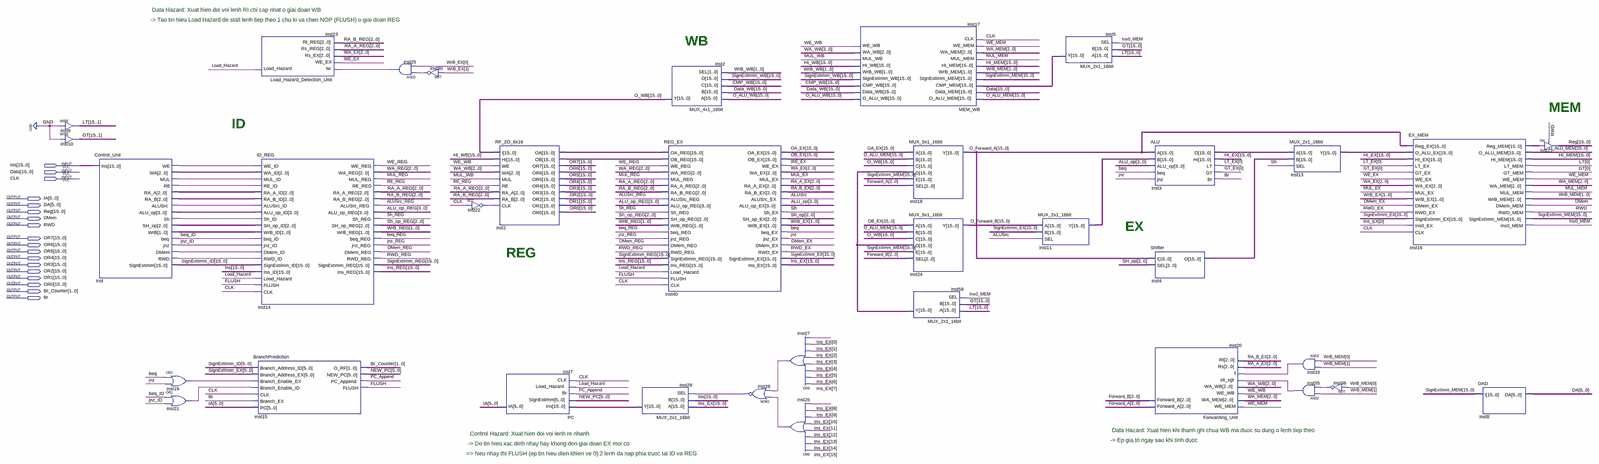
[diagram p0: schematic sheet, whole]
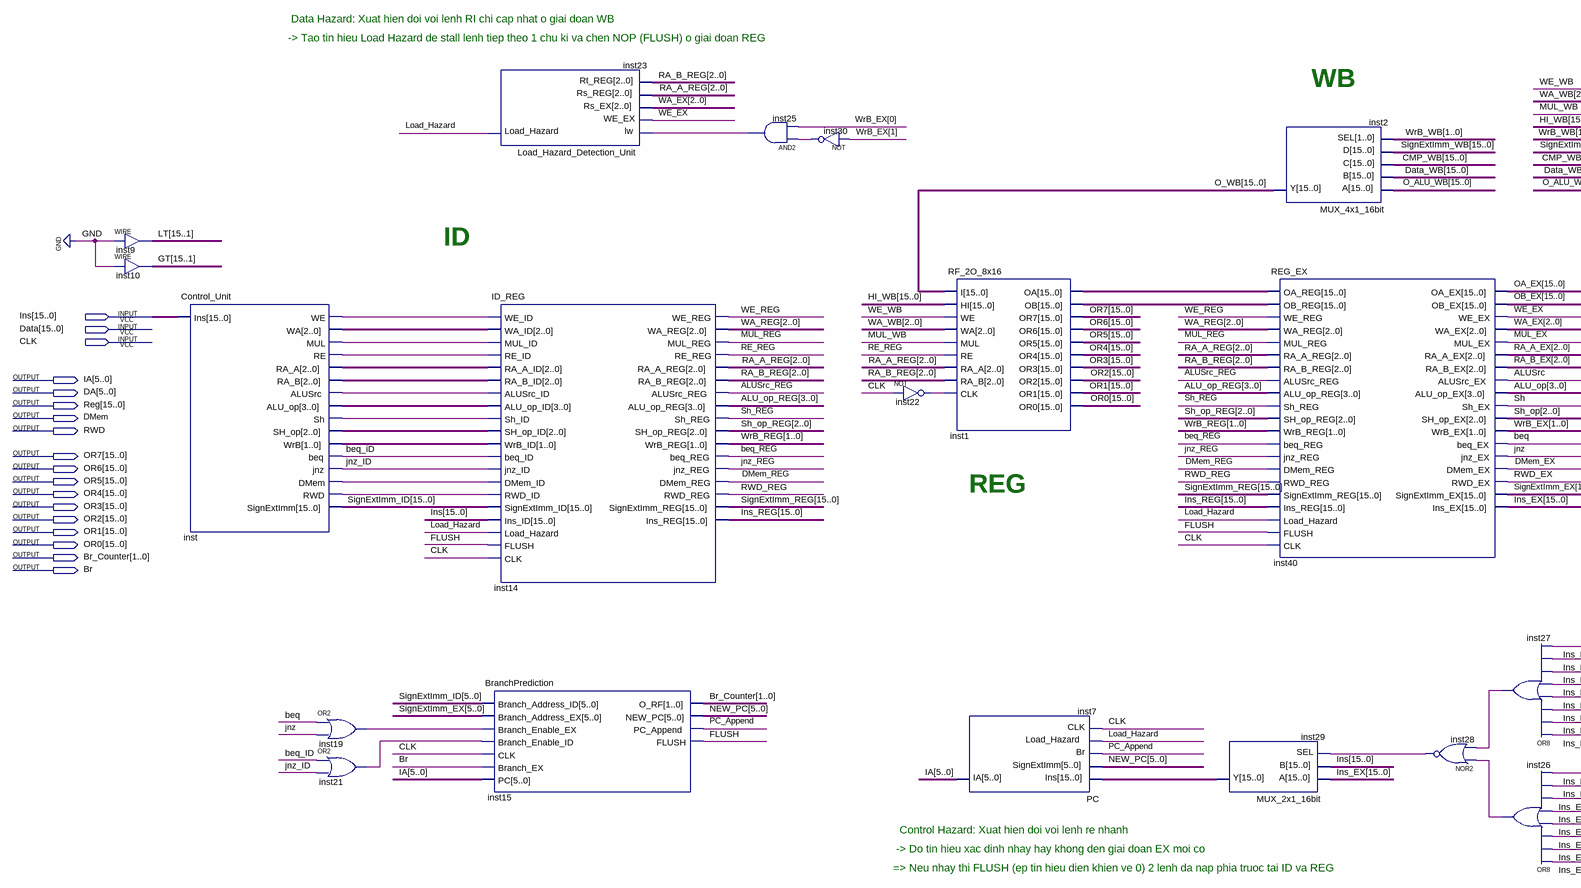
[diagram p1: schematic sheet, left part]
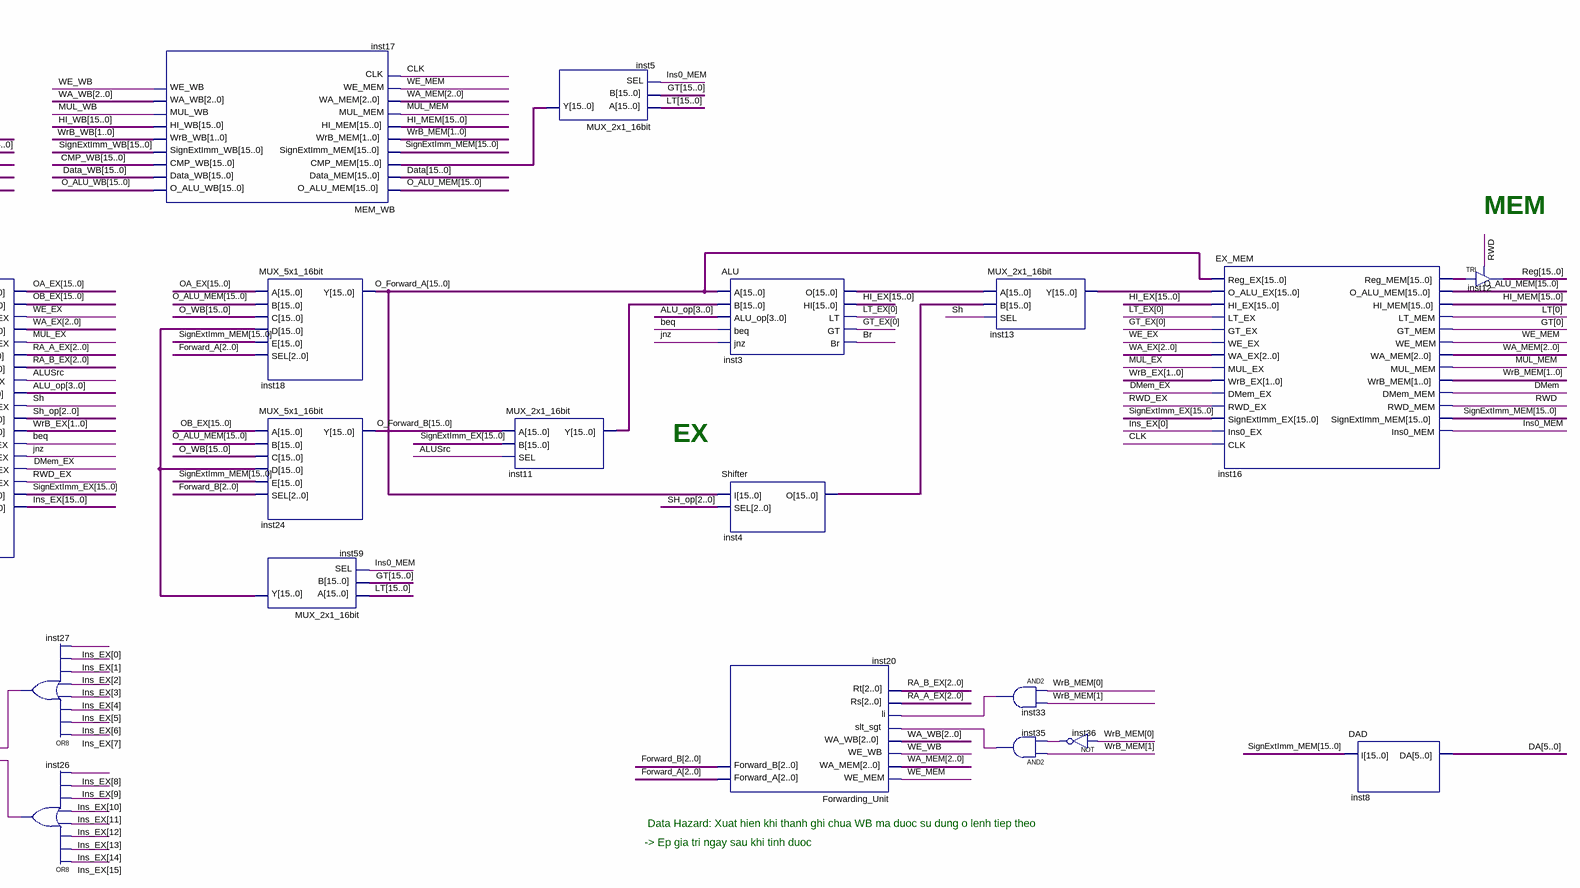
[diagram p2: schematic sheet, right part]
// Quartus schematic CPU_16bit.bdf as structural Verilog: 35 symbols, 18 pins
module CPU_16bit (
  input  [15:0] Ins,
  input  [15:0] Data,
  input  CLK,
  output [5:0] IA,
  output [5:0] DA,
  output [15:0] Reg,
  output DMem,
  output RWD,
  output [15:0] OR7,
  output [15:0] OR6,
  output [15:0] OR5,
  output [15:0] OR4,
  output [15:0] OR3,
  output [15:0] OR2,
  output [15:0] OR1,
  output [15:0] OR0,
  output [1:0] Br_Counter,
  output Br
);

  wire ALUSrc, ALUSrc_REG, beq, beq_iD, beq_REG, DMem_EX, DMem_REG, FLUSH, Ins0_MEM, inst19_out, inst21_out,
       inst22_out, inst25_out, inst26_out, inst27_out, inst28_out, inst30_out, inst33_out, inst35_out,
       inst36_out, inst_alusrc, inst_dmem, inst_mul, inst_re, inst_rwd, inst_sh, inst_we, jnz, jnz_ID,
       jnz_REG, Load_Hazard, MUL_EX, MUL_MEM, MUL_REG, MUL_WB, PC_Append, RE_REG, RWD_EX, RWD_REG, Sh,
       Sh_REG, WE_EX, WE_MEM, WE_REG, WE_WB;
  wire [0:0] GT_EX, LT_EX;
  wire [1:0] inst_wrb, WrB_EX, WrB_MEM, WrB_REG, WrB_WB;
  wire [2:0] Forward_A, Forward_B, inst_ra_a, inst_ra_b, inst_sh_op, inst_wa, RA_A_EX, RA_A_REG, RA_B_EX,
       RA_B_REG, Sh_op, Sh_op_REG, WA_EX, WA_MEM, WA_REG, WA_WB;
  wire [3:0] ALU_op, ALU_op_REG, inst_alu_op;
  wire [5:0] NEW_PC;
  wire [15:0] CMP_WB, Data_WB, GT, HI_EX, HI_MEM, HI_WB, Ins_EX, Ins_REG, inst1_oa, inst1_ob, inst3_o,
       inst4_o, inst5_y, inst11_y, inst13_y, inst16_reg_mem, inst29_y, inst59_y, LT, O_ALU_MEM, O_ALU_WB,
       O_Forward_A, O_Forward_B, O_WB, OA_EX, OB_EX, SignExtImm_EX, SignExtImm_ID, SignExtImm_MEM,
       SignExtImm_REG, SignExtImm_WB;

  assign LT[15:1] = {15{1'b0}};  // WIRE inst9
  assign GT[15:1] = {15{1'b0}};  // WIRE inst10
  Control_Unit inst (
    .Ins(Ins), .WE(inst_we), .WA(inst_wa), .MUL(inst_mul), .RE(inst_re), .RA_A(inst_ra_a), .RA_B(inst_ra_b),
    .ALUSrc(inst_alusrc), .ALU_op(inst_alu_op), .Sh(inst_sh), .SH_op(inst_sh_op), .WrB(inst_wrb),
    .beq(beq_iD), .jnz(jnz_ID), .DMem(inst_dmem), .RWD(inst_rwd), .SignExtImm(SignExtImm_ID));
  or inst19 (inst19_out, beq, jnz);
  or inst21 (inst21_out, beq_iD, jnz_ID);
  BranchPrediction inst15 (
    .Branch_Address_ID(SignExtImm_ID[5:0]), .Branch_Address_EX(SignExtImm_EX[5:0]),
    .Branch_Enable_EX(inst19_out), .Branch_Enable_ID(inst21_out), .CLK(CLK), .Branch_EX(Br), .PC(IA),
    .O_RF(Br_Counter), .NEW_PC(NEW_PC), .PC_Append(PC_Append), .FLUSH(FLUSH));
  Load_Hazard_Detection_Unit inst23 (
    .lw(inst25_out), .WE_EX(WE_EX), .Rs_EX(WA_EX), .Rs_REG(RA_A_REG), .Rt_REG(RA_B_REG),
    .Load_Hazard(Load_Hazard));
  ID_REG inst14 (
    .WE_ID(inst_we), .WA_ID(inst_wa), .MUL_ID(inst_mul), .RE_ID(inst_re), .RA_A_ID(inst_ra_a),
    .RA_B_ID(inst_ra_b), .ALUSrc_ID(inst_alusrc), .ALU_op_ID(inst_alu_op), .Sh_ID(inst_sh),
    .SH_op_ID(inst_sh_op), .WrB_ID(inst_wrb), .beq_ID(beq_iD), .jnz_ID(jnz_ID), .DMem_ID(inst_dmem),
    .RWD_ID(inst_rwd), .SignExtImm_ID(SignExtImm_ID), .Ins_ID(Ins), .Load_Hazard(Load_Hazard), .FLUSH(FLUSH),
    .CLK(CLK), .WE_REG(WE_REG), .WA_REG(WA_REG), .MUL_REG(MUL_REG), .RE_REG(RE_REG), .RA_A_REG(RA_A_REG),
    .RA_B_REG(RA_B_REG), .ALUSrc_REG(ALUSrc_REG), .ALU_op_REG(ALU_op_REG), .Sh_REG(Sh_REG),
    .SH_op_REG(Sh_op_REG), .WrB_REG(WrB_REG), .beq_REG(beq_REG), .jnz_REG(jnz_REG), .DMem_REG(DMem_REG),
    .RWD_REG(RWD_REG), .SignExtImm_REG(SignExtImm_REG), .Ins_REG(Ins_REG));
  and inst25 (inst25_out, inst30_out, WrB_EX[0]);
  not inst30 (inst30_out, WrB_EX[1]);
  not inst22 (inst22_out, CLK);
  RF_2O_8x16 inst1 (
    .I(O_WB), .HI(HI_WB), .WE(WE_WB), .WA(WA_WB), .MUL(MUL_WB), .RE(RE_REG), .RA_A(RA_A_REG),
    .RA_B(RA_B_REG), .CLK(inst22_out), .OA(inst1_oa), .OB(inst1_ob), .OR7(OR7), .OR6(OR6), .OR5(OR5),
    .OR4(OR4), .OR3(OR3), .OR2(OR2), .OR1(OR1), .OR0(OR0));
  PC inst7 (.Ins(inst29_y), .SignExtImm(NEW_PC), .Br(PC_Append), .Load_Hazard(Load_Hazard), .CLK(CLK), .IA(IA));
  MUX_2x1_16bit inst29 (.A(Ins_EX), .B(Ins), .SEL(inst28_out), .Y(inst29_y));
  MUX_4x1_16bit inst2 (.A(O_ALU_WB), .B(Data_WB), .C(CMP_WB), .D(SignExtImm_WB), .SEL(WrB_WB), .Y(O_WB));
  REG_EX inst40 (
    .OA_REG(inst1_oa), .OB_REG(inst1_ob), .WE_REG(WE_REG), .WA_REG(WA_REG), .MUL_REG(MUL_REG),
    .RA_A_REG(RA_A_REG), .RA_B_REG(RA_B_REG), .ALUSrc_REG(ALUSrc_REG), .ALU_op_REG(ALU_op_REG),
    .Sh_REG(Sh_REG), .SH_op_REG(Sh_op_REG), .WrB_REG(WrB_REG), .beq_REG(beq_REG), .jnz_REG(jnz_REG),
    .DMem_REG(DMem_REG), .RWD_REG(RWD_REG), .SignExtImm_REG(SignExtImm_REG), .Ins_REG(Ins_REG),
    .Load_Hazard(Load_Hazard), .FLUSH(FLUSH), .CLK(CLK), .OA_EX(OA_EX), .OB_EX(OB_EX), .WE_EX(WE_EX),
    .WA_EX(WA_EX), .MUL_EX(MUL_EX), .RA_A_EX(RA_A_EX), .RA_B_EX(RA_B_EX), .ALUSrc_EX(ALUSrc),
    .ALU_op_EX(ALU_op), .Sh_EX(Sh), .SH_op_EX(Sh_op), .WrB_EX(WrB_EX), .beq_EX(beq), .jnz_EX(jnz),
    .DMem_EX(DMem_EX), .RWD_EX(RWD_EX), .SignExtImm_EX(SignExtImm_EX), .Ins_EX(Ins_EX));
  nor inst28 (inst28_out, inst26_out, inst27_out);
  or inst27 (inst27_out, Ins_EX[7], Ins_EX[6], Ins_EX[5], Ins_EX[4], Ins_EX[3], Ins_EX[2], Ins_EX[1], Ins_EX[0]);
  or inst26 (inst26_out, Ins_EX[15], Ins_EX[14], Ins_EX[13], Ins_EX[12], Ins_EX[11], Ins_EX[10], Ins_EX[9], Ins_EX[8]);
  MEM_WB inst17 (
    .O_ALU_MEM(O_ALU_MEM), .Data_MEM(Data), .CMP_MEM(inst5_y), .SignExtImm_MEM(SignExtImm_MEM),
    .WrB_MEM(WrB_MEM), .HI_MEM(HI_MEM), .MUL_MEM(MUL_MEM), .WA_MEM(WA_MEM), .WE_MEM(WE_MEM), .CLK(CLK),
    .O_ALU_WB(O_ALU_WB), .Data_WB(Data_WB), .CMP_WB(CMP_WB), .SignExtImm_WB(SignExtImm_WB), .WrB_WB(WrB_WB),
    .HI_WB(HI_WB), .MUL_WB(MUL_WB), .WA_WB(WA_WB), .WE_WB(WE_WB));
  MUX_5x1_16bit inst18 (
    .A(OA_EX), .B(O_ALU_MEM), .C(O_WB), .D(inst59_y), .E(SignExtImm_MEM), .SEL(Forward_A), .Y(O_Forward_A));
  MUX_5x1_16bit inst24 (
    .A(OB_EX), .B(O_ALU_MEM), .C(O_WB), .D(inst59_y), .E(SignExtImm_MEM), .SEL(Forward_B), .Y(O_Forward_B));
  MUX_2x1_16bit inst59 (.A(LT), .B(GT), .SEL(Ins0_MEM), .Y(inst59_y));
  MUX_2x1_16bit inst11 (.A(O_Forward_B), .B(SignExtImm_EX), .SEL(ALUSrc), .Y(inst11_y));
  MUX_2x1_16bit inst5 (.A(LT), .B(GT), .SEL(Ins0_MEM), .Y(inst5_y));
  ALU inst3 (
    .A(O_Forward_A), .B(inst11_y), .ALU_op(ALU_op), .beq(beq), .jnz(jnz), .O(inst3_o), .HI(HI_EX),
    .LT(LT_EX[0]), .GT(GT_EX[0]), .Br(Br));
  Shifter inst4 (.I(O_Forward_A), .SEL(Sh_op), .O(inst4_o));
  Forwarding_Unit inst20 (
    .WE_MEM(WE_MEM), .WA_MEM(WA_MEM), .WE_WB(WE_WB), .WA_WB(WA_WB), .slt_sgt(inst35_out), .li(inst33_out),
    .Rs(RA_A_EX), .Rt(RA_B_EX), .Forward_A(Forward_A), .Forward_B(Forward_B));
  MUX_2x1_16bit inst13 (.A(inst3_o), .B(inst4_o), .SEL(Sh), .Y(inst13_y));
  and inst33 (inst33_out, WrB_MEM[0], WrB_MEM[1]);
  and inst35 (inst35_out, WrB_MEM[1], inst36_out);
  not inst36 (inst36_out, WrB_MEM[0]);
  EX_MEM inst16 (
    .Reg_EX(O_Forward_A), .O_ALU_EX(inst13_y), .HI_EX(HI_EX), .LT_EX(LT_EX[0]), .GT_EX(GT_EX[0]),
    .WE_EX(WE_EX), .WA_EX(WA_EX), .MUL_EX(MUL_EX), .WrB_EX(WrB_EX), .DMem_EX(DMem_EX), .RWD_EX(RWD_EX),
    .SignExtImm_EX(SignExtImm_EX), .Ins0_EX(Ins_EX[0]), .CLK(CLK), .Reg_MEM(inst16_reg_mem),
    .O_ALU_MEM(O_ALU_MEM), .HI_MEM(HI_MEM), .LT_MEM(LT[0]), .GT_MEM(GT[0]), .WE_MEM(WE_MEM), .WA_MEM(WA_MEM),
    .MUL_MEM(MUL_MEM), .WrB_MEM(WrB_MEM), .DMem_MEM(DMem), .RWD_MEM(RWD), .SignExtImm_MEM(SignExtImm_MEM),
    .Ins0_MEM(Ins0_MEM));
  DAD inst8 (.I(SignExtImm_MEM), .DA(DA));
  TRI inst12[15:0] (.IN(inst16_reg_mem), .OE(RWD), .OUT(Reg));

  // Notes on the sheet:
  //   Data Hazard: Xuat hien doi voi lenh RI chi cap nhat o giai doan WB
  //    -> Tao tin hieu Load Hazard de stall lenh tiep theo 1 chu ki va chen NOP (FLUSH) o giai doan REG
  //   WB
  //   MEM
  //   ID
  //   EX
  //   REG
  //   Data Hazard: Xuat hien khi thanh ghi chua WB ma duoc su dung o lenh tiep theo
  //   Control Hazard: Xuat hien doi voi lenh re nhanh
  //    -> Ep gia tri ngay sau khi tinh duoc
  //    -> Do tin hieu xac dinh nhay hay khong den giai doan EX moi co
  //   => Neu nhay thi FLUSH (ep tin hieu dien khien ve 0) 2 lenh da nap phia truoc tai ID va REG
endmodule
